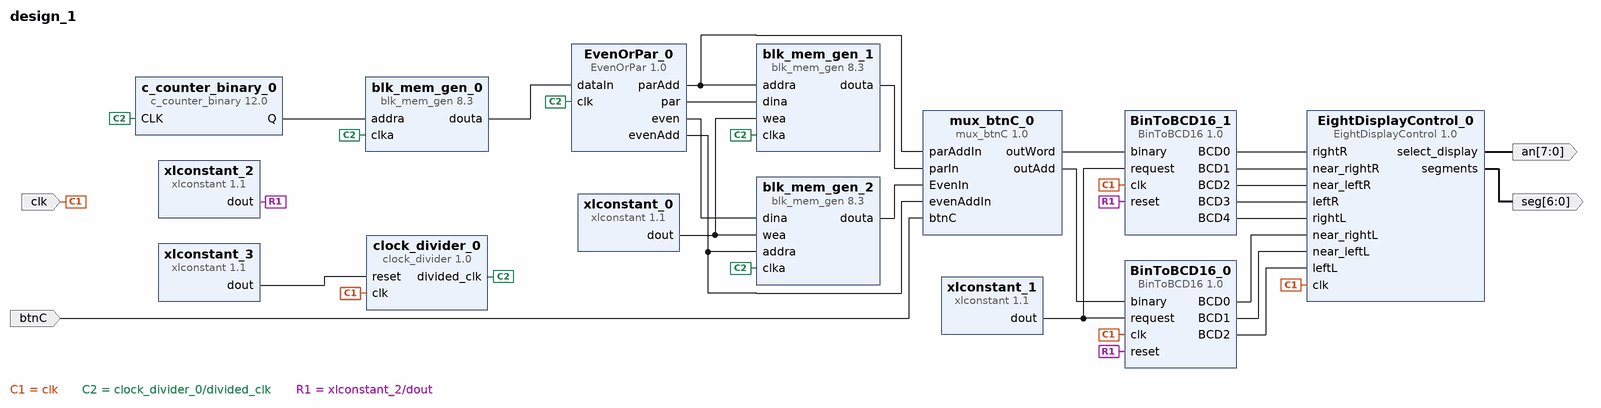
[diagram p0: block diagram of the top level]
# Vivado block design design_1, xc7a100tcsg324-1, Vivado 2016.4
create_bd_design design_1

create_bd_port -dir I -type clk clk
create_bd_port -dir I -type rst btnC
set_property -dict {CONFIG.POLARITY ACTIVE_HIGH} [get_bd_ports btnC]
create_bd_port -dir O -from 7 -to 0 an
create_bd_port -dir O -from 6 -to 0 seg

create_bd_cell -type ip -vlnv xilinx.com:ip:blk_mem_gen:8.3 blk_mem_gen_0
set_property -dict [list \
  CONFIG.Memory_Type Single_Port_ROM \
  CONFIG.Enable_32bit_Address false \
  CONFIG.Write_Width_A 16 \
  CONFIG.Enable_A Always_Enabled \
  CONFIG.Register_PortA_Output_of_Memory_Primitives false \
  CONFIG.Load_Init_File true \
  CONFIG.Coe_File ../../../../../../../../Aula3/Aula3_estudo_ex4/coe/aula5_estudo_ex1.coe \
  CONFIG.Use_RSTA_Pin false \
  CONFIG.Port_A_Write_Rate 0 \
  CONFIG.use_bram_block Stand_Alone \
] [get_bd_cells blk_mem_gen_0]
create_bd_cell -type ip -vlnv xilinx.com:user:clock_divider:1.0 clock_divider_0
set_property -dict {CONFIG.how_fast 26} [get_bd_cells clock_divider_0]
create_bd_cell -type ip -vlnv xilinx.com:ip:blk_mem_gen:8.3 blk_mem_gen_1
set_property -dict [list \
  CONFIG.Enable_32bit_Address false \
  CONFIG.Use_Byte_Write_Enable false \
  CONFIG.Write_Width_A 16 \
  CONFIG.Read_Width_A 16 \
  CONFIG.Enable_A Always_Enabled \
  CONFIG.Register_PortA_Output_of_Memory_Primitives false \
  CONFIG.Use_RSTA_Pin false \
  CONFIG.use_bram_block Stand_Alone \
] [get_bd_cells blk_mem_gen_1]
create_bd_cell -type ip -vlnv xilinx.com:ip:blk_mem_gen:8.3 blk_mem_gen_2
set_property -dict [list \
  CONFIG.Enable_32bit_Address false \
  CONFIG.Use_Byte_Write_Enable false \
  CONFIG.Write_Width_A 16 \
  CONFIG.Read_Width_A 16 \
  CONFIG.Enable_A Always_Enabled \
  CONFIG.Register_PortA_Output_of_Memory_Primitives false \
  CONFIG.Use_RSTA_Pin false \
  CONFIG.use_bram_block Stand_Alone \
] [get_bd_cells blk_mem_gen_2]
create_bd_cell -type ip -vlnv xilinx.com:ip:c_counter_binary:12.0 c_counter_binary_0
set_property -dict {CONFIG.Output_Width 7} [get_bd_cells c_counter_binary_0]
create_bd_cell -type ip -vlnv xilinx.com:user:EvenOrPar:1.0 EvenOrPar_0
create_bd_cell -type ip -vlnv xilinx.com:ip:xlconstant:1.1 xlconstant_0
create_bd_cell -type ip -vlnv xilinx.com:user:BinToBCD16:1.0 BinToBCD16_0
create_bd_cell -type ip -vlnv xilinx.com:user:EightDisplayControl:1.0 EightDisplayControl_0
create_bd_cell -type ip -vlnv xilinx.com:user:BinToBCD16:1.0 BinToBCD16_1
create_bd_cell -type ip -vlnv xilinx.com:ip:xlconstant:1.1 xlconstant_1
create_bd_cell -type ip -vlnv xilinx.com:ip:xlconstant:1.1 xlconstant_2
set_property -dict {CONFIG.CONST_VAL 0} [get_bd_cells xlconstant_2]
create_bd_cell -type ip -vlnv xilinx.com:ip:xlconstant:1.1 xlconstant_3
set_property -dict {CONFIG.CONST_VAL 0} [get_bd_cells xlconstant_3]
create_bd_cell -type ip -vlnv xilinx.com:user:mux_btnC:1.0 mux_btnC_0

# ---- connections ----

connect_bd_net [get_bd_ports clk] \
  [get_bd_pins clock_divider_0/clk] [get_bd_pins BinToBCD16_1/clk] [get_bd_pins BinToBCD16_0/clk] \
  [get_bd_pins EightDisplayControl_0/clk]
connect_bd_net [get_bd_pins clock_divider_0/divided_clk] \
  [get_bd_pins c_counter_binary_0/CLK] [get_bd_pins blk_mem_gen_0/clka] [get_bd_pins EvenOrPar_0/clk] \
  [get_bd_pins blk_mem_gen_1/clka] [get_bd_pins blk_mem_gen_2/clka]
connect_bd_net [get_bd_pins c_counter_binary_0/Q] [get_bd_pins blk_mem_gen_0/addra]
connect_bd_net [get_bd_pins blk_mem_gen_0/douta] [get_bd_pins EvenOrPar_0/dataIn]
connect_bd_net [get_bd_pins EvenOrPar_0/par] [get_bd_pins blk_mem_gen_1/dina]
connect_bd_net [get_bd_pins EvenOrPar_0/even] [get_bd_pins blk_mem_gen_2/dina]
connect_bd_net [get_bd_pins EvenOrPar_0/parAdd] [get_bd_pins blk_mem_gen_1/addra] [get_bd_pins mux_btnC_0/parAddIn]
connect_bd_net [get_bd_pins EvenOrPar_0/evenAdd] [get_bd_pins blk_mem_gen_2/addra] [get_bd_pins mux_btnC_0/evenAddIn]
connect_bd_net [get_bd_pins xlconstant_0/dout] [get_bd_pins blk_mem_gen_2/wea] [get_bd_pins blk_mem_gen_1/wea]
connect_bd_net [get_bd_pins xlconstant_1/dout] [get_bd_pins BinToBCD16_0/request] [get_bd_pins BinToBCD16_1/request]
connect_bd_net [get_bd_pins xlconstant_2/dout] [get_bd_pins BinToBCD16_1/reset] [get_bd_pins BinToBCD16_0/reset]
connect_bd_net [get_bd_pins BinToBCD16_1/BCD0] [get_bd_pins EightDisplayControl_0/rightR]
connect_bd_net [get_bd_pins BinToBCD16_1/BCD1] [get_bd_pins EightDisplayControl_0/near_rightR]
connect_bd_net [get_bd_pins BinToBCD16_1/BCD2] [get_bd_pins EightDisplayControl_0/near_leftR]
connect_bd_net [get_bd_pins BinToBCD16_1/BCD3] [get_bd_pins EightDisplayControl_0/leftR]
connect_bd_net [get_bd_pins BinToBCD16_1/BCD4] [get_bd_pins EightDisplayControl_0/rightL]
connect_bd_net [get_bd_pins BinToBCD16_0/BCD0] [get_bd_pins EightDisplayControl_0/near_rightL]
connect_bd_net [get_bd_pins BinToBCD16_0/BCD1] [get_bd_pins EightDisplayControl_0/near_leftL]
connect_bd_net [get_bd_pins BinToBCD16_0/BCD2] [get_bd_pins EightDisplayControl_0/leftL]
connect_bd_net [get_bd_pins EightDisplayControl_0/select_display] [get_bd_ports an]
connect_bd_net [get_bd_pins EightDisplayControl_0/segments] [get_bd_ports seg]
connect_bd_net [get_bd_pins xlconstant_3/dout] [get_bd_pins clock_divider_0/reset]
connect_bd_net [get_bd_ports btnC] [get_bd_pins mux_btnC_0/btnC]
connect_bd_net [get_bd_pins mux_btnC_0/outAdd] [get_bd_pins BinToBCD16_0/binary]
connect_bd_net [get_bd_pins mux_btnC_0/outWord] [get_bd_pins BinToBCD16_1/binary]
connect_bd_net [get_bd_pins blk_mem_gen_1/douta] [get_bd_pins mux_btnC_0/parIn]
connect_bd_net [get_bd_pins blk_mem_gen_2/douta] [get_bd_pins mux_btnC_0/EvenIn]

validate_bd_design
save_bd_design
